# Altium schematic sheet AFE.SchDoc
size A3; SheetNumber: 6; SheetTotal: 10
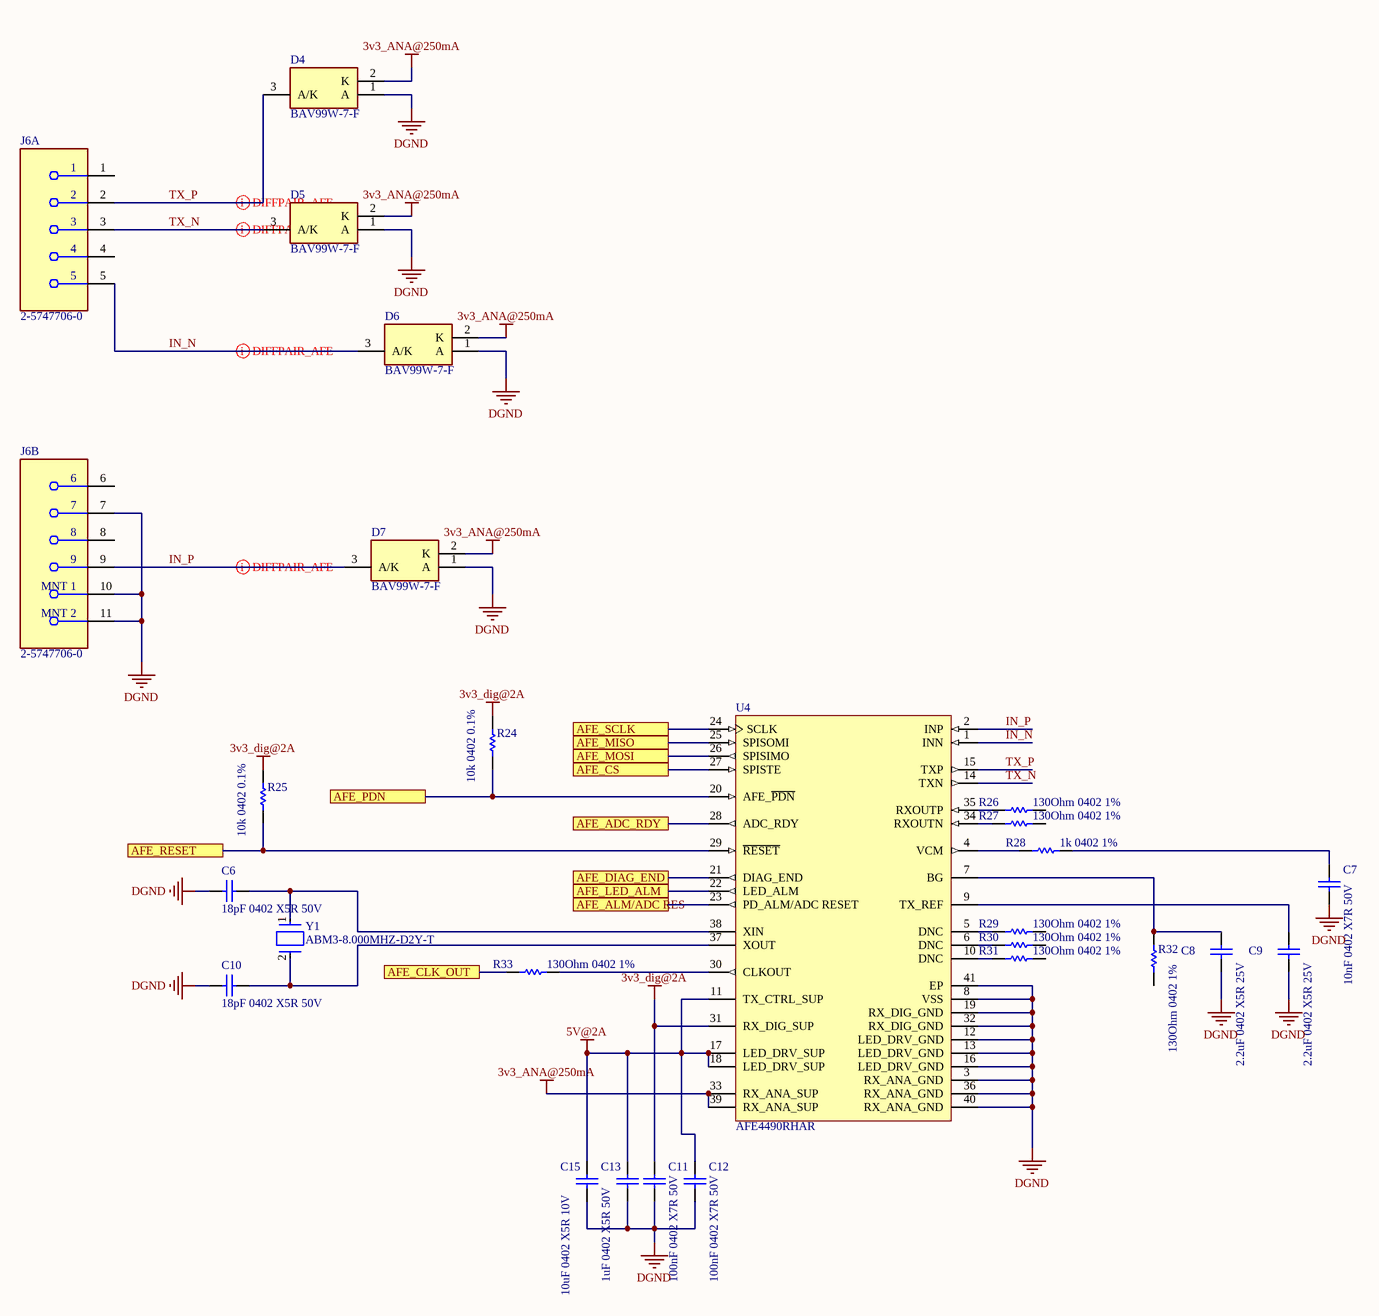
[diagram p0: AFE.SchDoc]

## Parts
C6  18pF 0402 X5R 50V  [CAPC1005X55X25NL5T10]
C7  10nF 0402 X7R 50V  [CAPC1005X55X25NL5T10]
C8  2.2uF 0402 X5R 25V  [CAPC1005X55X25NL5T10]
C9  2.2uF 0402 X5R 25V  [CAPC1005X55X25NL5T10]
C10  18pF 0402 X5R 50V  [CAPC1005X55X25NL5T10]
C11  100nF 0402 X7R 50V  [CAPC1005X55X25NL5T10]
C12  100nF 0402 X7R 50V  [CAPC1005X55X25NL5T10]
C13  1uF 0402 X5R 50V  [CAPC1005X55X25NL5T10]
C15  10uF 0402 X5R 10V  [CAPC1005X55X25NL5T10]
D4  BAV99W-7-F  [SOT65P210X110-3N]
D5  BAV99W-7-F  [SOT65P210X110-3N]
D6  BAV99W-7-F  [SOT65P210X110-3N]
D7  BAV99W-7-F  [SOT65P210X110-3N]
J6  2-5747706-0  [FP-2-5747706-0-MFG]  (parts A,B of 2)
R24  10k 0402 0.1%  [RESC1005X40X25ML05T10]
R25  10k 0402 0.1%  [RESC1005X40X25ML05T10]
R26  130Ohm 0402 1%  [RESC1005X40X25ML05T10]
R27  130Ohm 0402 1%  [RESC1005X40X25ML05T10]
R28  1k 0402 1%  [RESC1005X40X25ML05T10]
R29  130Ohm 0402 1%  [RESC1005X40X25ML05T10]
R30  130Ohm 0402 1%  [RESC1005X40X25ML05T10]
R31  130Ohm 0402 1%  [RESC1005X40X25ML05T10]
R32  130Ohm 0402 1%  [RESC1005X40X25ML05T10]
R33  130Ohm 0402 1%  [RESC1005X40X25ML05T10]
U4  AFE4490RHAR  [RHA0040B_V]
Y1  ABM3-8.000MHZ-D2Y-T  [FP-ABM3-MFG]

## Ports
AFE_ADC_RDY, AFE_ALM/ADC RES, AFE_CLK_OUT, AFE_CS, AFE_DIAG_END, AFE_LED_ALM, AFE_MISO, AFE_MOSI, AFE_PDN, AFE_RESET, AFE_SCLK

## Nets
3v3_ANA@250mA: D4.2(K) D5.2(K) D6.2(K) D7.2(K) U4.33(RX_ANA_SUP) U4.39(RX_ANA_SUP)
3v3_dig@2A: C11.2 R24.2 R25.2 U4.31(RX_DIG_SUP)
5V@2A: C12.2 C13.2 C15.2 U4.11(TX_CTRL_SUP) U4.17(LED_DRV_SUP) U4.18(LED_DRV_SUP)
DGND: C6.1 C7.1 C8.1 C9.1 C10.1 C11.1 C12.1 C13.1 C15.1 D4.1(A) D5.1(A) D6.1(A) D7.1(A) J6.7 J6.10(MNT_1) J6.11(MNT_2) U4.3(RX_ANA_GND) U4.8(VSS) U4.12(LED_DRV_GND) U4.13(LED_DRV_GND) U4.16(LED_DRV_GND) U4.19(RX_DIG_GND) U4.32(RX_DIG_GND) U4.36(RX_ANA_GND) U4.40(RX_ANA_GND) U4.41(EP)
AFE_ADC_RDY: U4.28(ADC_RDY) ; port AFE_ADC_RDY
AFE_ALM/ADC RES: U4.23(PD_ALM/ADC_RESET) ; port AFE_ALM/ADC RES
AFE_CLK_OUT: R33.2 ; port AFE_CLK_OUT
AFE_CS: U4.27(SPISTE) ; port AFE_CS
AFE_DIAG_END: U4.21(DIAG_END) ; port AFE_DIAG_END
AFE_LED_ALM: U4.22(LED_ALM) ; port AFE_LED_ALM
AFE_MISO: U4.25(SPISOMI) ; port AFE_MISO
AFE_MOSI: U4.26(SPISIMO) ; port AFE_MOSI
AFE_PDN: R24.1 U4.20(AFE_~{PDN}) ; port AFE_PDN
AFE_RESET: R25.1 U4.29(~{RESET}) ; port AFE_RESET
AFE_SCLK: U4.24(SCLK) ; port AFE_SCLK
IN_N: D6.3(A/K) J6.5 U4.1(INN)
IN_P: D7.3(A/K) J6.9 U4.2(INP)
TX_N: D5.3(A/K) J6.3 U4.14(TXN)
TX_P: D4.3(A/K) J6.2 U4.15(TXP)
NetC6_2: C6.2 U4.38(XIN) Y1.1
NetC7_2: C7.2 R28.1
NetC8_2: C8.2 R32.2 U4.7(BG)
NetC9_2: C9.2 U4.9(TX_REF)
NetC10_2: C10.2 U4.37(XOUT) Y1.2
NetR26_2: R26.2 U4.35(RXOUTP)
NetR27_2: R27.2 U4.34(RXOUTN)
NetR28_2: R28.2 U4.4(VCM)
NetR29_2: R29.2 U4.5(DNC)
NetR30_2: R30.2 U4.6(DNC)
NetR31_2: R31.2 U4.10(DNC)
NetR33_1: R33.1 U4.30(CLKOUT)

Not connected (* = marked no-connect by the designer): J6 1 4 6 8; R26 1; R27 1; R29 1; R30 1; R31 1; R32 1

## Layout directives
differential pair; differential pair class AFE: IN_N, IN_P, TX_N, TX_P

## Library data of the parts
C6-C13 C15 = CMP-1662-00020-1: ComponentLink2Description: Datasheet; ComponentLink2URL: http://psearch.en.murata.com/capacitor/product/GRM155R60J105KE19%23.pdf; ComponentLink1Description: Manufacturer URL; ComponentLink1URL: http://www.murata.com/
  C6 C10: LCSC_PN: C33149
  C7: LCSC_PN: C60133
  C8 C9: LCSC_PN: C77002
  C11 C12: LCSC_PN: C77020
  C13: LCSC_PN: C1518208
  C15: LCSC_PN: C77000
D4-D7 = BAV99W-7-F: Diode; Manufacturer_Name: Diodes Inc.; Datasheet Link: https://www.diodes.com/assets/Datasheets/ds30045.pdf; Height: 1.1mm; Manufacturer_Part_Number: BAV99W-7-F; Mouser Part Number: 621-BAV99W-F; Mouser Price/Stock: https://www.mouser.co.uk/ProductDetail/Diodes-Incorporated/BAV99W-7-F?qs=KrBKXozF1ElcNxS3QKF7wg%3D%3D; Arrow Part Number: BAV99W-7-F; Arrow Price/Stock: https://www.arrow.com/en/products/bav99w-7-f/diodes-incorporated?region=europe; LCSC_PN: C93035
J6 = CMP-03367-000004-1: CONN D-SUB RCPT 9POS VERT SOLDER; Manufacturer: TE Connectivity; Is Female: yes; Conn Orientation: Vertical; Current Rating: 6A; Shielding: true; Number Of Contacts: 9; Conn Gender: Female; Pitch: 2.74mm; RoHS: TRUE; Temperature: -55°C to +105°C; Package: 2-5747706-0; Category: Conn; Automotive: No; Device Class L3: unset; Octopart: https://octopart.com/2-5747706-0-te+connectivity-39499683; Lead Free: Yes; Contact Material: Gold,Nickel; Height: 0.494inch; Temperature Range High: +105°C; Device Class L1: Connectors; ComponentLink2Description: Datasheet; Mouser Description: D-Sub Standard Connectors RECP FRNT MTL SHL 9P retention inserts; ComponentLink2URL: https://www.te.com/commerce/DocumentDelivery/DDEController?Action=showdoc&DocId=Customer+Drawing%7F5747706%7FB%7Fpdf%7FEnglish%7FENG_CD_5747706_B.pdf%7F2-5747706-0; Digikey Description: CONN D-SUB RCPT 9POS VERT SOLDER; Temperature Range Low: -55°C; Manufacturer Part Number: 2-5747706-0; Device Class L2: D-Sub Connectors; LCSC_PN: C189689
R24-R33 = CMP-2002-07472-1
  R24 R25: LCSC_PN: C190095
  R26 R27 R29-R33: LCSC_PN: C413066
  R28: LCSC_PN: C106235
U4 = CMP-0767-00003-2: Integrated Analog Front End for Pulse Oximeter, 2 to 3.6 V Rx, 3 to 5.25 V Tx, -40 to 85 degC, 40-Pin VQFN (RHA), RoHS, Tape and Reel; Manufacturer: Texas Instruments; CMRR: 75 dB; Resolution: 22 Bits; Sample Rate (max): 1.3 KSPS; Packing: RHA0040B; # Input Channels: 1; ComponentLink3Description: Package Specification; ComponentLink2Description: Datasheet; RoHS: TRUE; ComponentLink2URL: http://www.ti.com/lit/ds/symlink/afe4490.pdf; ComponentLink1Description: Manufacturer URL; DatasheetVersion: SBAS602F; AFE Digital Supply: 2 to 3.6 V; ComponentLink1URL: http://www.ti.com/; PartNumber: AFE4490RHAR; PackageVersion: 4204276/E; Operating Temperature Range: -40 to 85 degC; PackageReference: RHA-40; PackageDescription: 40-Pin Plastic Quad Flatpack No-Lead, Body 6 x 6 mm, Pitch 0.5 mm; Transmit Controller Supply: 3 to 5.25 V; ComponentLink3URL: http://www.ti.com.cn/cn/lit/ml/mpqf135c/mpqf135c.pdf; AFE Analog Supply: 2 to 3.6 V; Mounting Technology: Surface Mount; LCSC_PN: C2651608
Y1 = CMP-2000-05033-2: Crystal 8MHz ±20ppm 18pF SMD-2 5mm x 3.2mm; Series Resistance: 500R; Frequency Stability: 30ppm; ESR (Equivalent Series Resistance): 140R; Load Capacitance: 18pF; Height: 0.051inch; Tolerance: 20ppm; Depth: 3.2mm; Max Operating Temperature: 85°C; Frequency: 8MHz; Termination: SMD/SMT; Lead Free: Lead Free; Number of Pins: 2; Width: 3.2mm; RoHS Compliant: Yes; Resistor Type: Ceramic; Length: 5mm; Mount: Surface Mount; Case/Package: CSMD; Package Quantity: 1000; Radiation Hardening: No; Min Operating Temperature: -40°C; Packaging: Tape and Reel; Frequency Tolerance: 20ppm; LCSC_PN: C144380